# Altium schematic sheet Sheet1.SchDoc
size A4; SheetNumber: 1; SheetTotal: 1
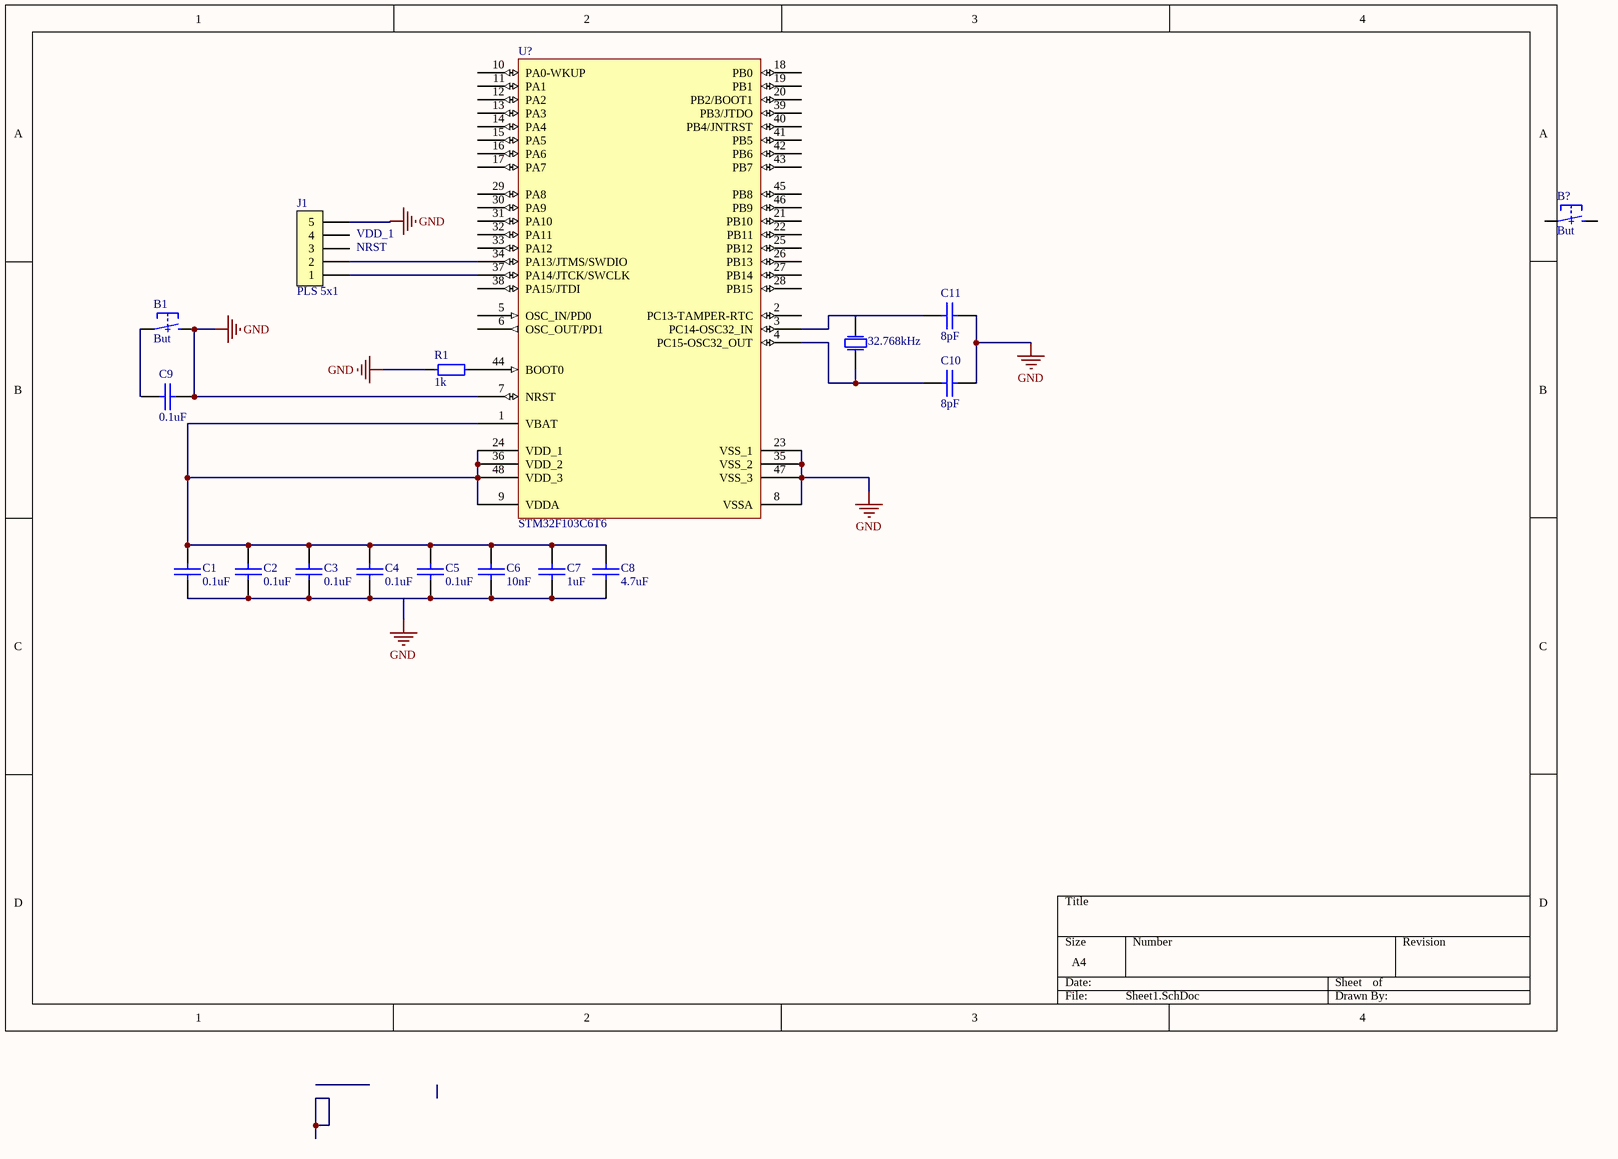
[diagram p0: Sheet1.SchDoc]

## Parts
?  32.768kHz  [Crystal ABM]
B1  But  [BUTTON 6x3.5]
B?  But  [BUTTON 6x3.5]
C1  0.1uF  [0805 Capicator]
C2  0.1uF  [0805 Capicator]
C3  0.1uF  [0805 Capicator]
C4  0.1uF  [0805 Capicator]
C5  0.1uF  [0805 Capicator]
C6  10nF  [0805 Capicator]
C7  1uF  [0805 Capicator]
C8  4.7uF  [0805 Capicator]
C9  0.1uF  [0805 Capicator]
C10  8pF  [0805 Capicator]
C11  8pF  [0805 Capicator]
J1  PLS 5x1  [PLS 5x1]
R1  1k  [0805 Resistor]
U?  STM32F103C6T6  [LQFP48_N]

## Nets
GND: B1.2 C9.2 C10.2 C11.2 J1.5 R1.1 U?.7(NRST) U?.8(VSSA) U?.23(VSS_1) U?.35(VSS_2) U?.47(VSS_3)
Net?_1: ?.1 C10.1 U?.4(PC15-OSC32_OUT)
NetC1_1: C1.1 C2.1 C3.1 C4.1 C5.1 C6.1 C7.1 C8.1
NetC1_2: C1.2 C2.2 C3.2 C4.2 C5.2 C6.2 C7.2 C8.2 U?.1(VBAT) U?.9(VDDA) U?.24(VDD_1) U?.36(VDD_2) U?.48(VDD_3)
NetC11_1: C11.1 U?.3(PC14-OSC32_IN)
NetJ1_1: J1.1 U?.37(PA14/JTCK/SWCLK)
NetJ1_2: J1.2 U?.34(PA13/JTMS/SWDIO)
NetR1_2: R1.2 U?.44(BOOT0)

Not connected (* = marked no-connect by the designer): ? 2; B1 1; B? 1 2; C9 1; J1 3 4; U? 2(PC13-TAMPER-RTC) 5(OSC_IN/PD0) 6(OSC_OUT/PD1) 10(PA0-WKUP) 11(PA1) 12(PA2) 13(PA3) 14(PA4) 15(PA5) 16(PA6) 17(PA7) 18(PB0) 19(PB1) 20(PB2/BOOT1) 21(PB10) 22(PB11) 25(PB12) 26(PB13) 27(PB14) 28(PB15) 29(PA8) 30(PA9) 31(PA10) 32(PA11) 33(PA12) 38(PA15/JTDI) 39(PB3/JTDO) 40(PB4/JNTRST) 41(PB5) 42(PB6) 43(PB7) 45(PB8) 46(PB9)

## Notes on the sheet
- (near J1) VDD_1
- (near J1) NRST

## Library data of the parts
? = Crystal 32.768kHz: 32.768kHz, SMD, 6 pF; Manufacturer: Seiko; Part Number: 9000417960; Type: Crystal; ComponentLink1Description: Chip&Dip; ComponentLink1URL: https://www.chipdip.ru/product/32.768-khz-smd-8mmx3.8mm-6-pf
B1 B? = Button 2 Conn: Button 2 Conn SMD; Part Number: L-KLS7-TS3608-5.0-180; Manufacturer: KLS electronic co ltd; Type: Button; ComponentLink1Description: Chip&Dip; ComponentLink1URL: https://www.chipdip.ru/product/kls7-ts3608-5.0-180-td-02xa
C1-C5 C9 = Cap 0.1uF (0805): 0.1uF X7R 25V 10% 0805; Manufacturer: Murata Manufacturing; Part Number: GRM21BR71E104KA01L; Type: Capacitor; ComponentLink1Description: Chip&Dip; ComponentLink1URL: https://www.chipdip.ru/product/grm21br71e104ka01l
C6 = Cap 10nF (0805): 0805 X7R 10nF 100V 10%; Manufacturer: Murata Manufacturing; Part Number: GRM21BR72A103KA01L; Type: Capacitor; ComponentLink1Description: Chip&Dip; ComponentLink1URL: https://www.chipdip.ru/product/grm21br72a103ka01l
C7 = Cap 1uF (0805): 1uF X7R 10% 16V 0805; Manufacturer: Murata Manufacturing; Part Number: GRM21BR71C105KA01K; Type: Capacitor; ComponentLink1Description: Chip&Dip; ComponentLink1URL: https://www.chipdip.ru/product/grm21br71c105k
C8 = Cap 4.7uF (0805): 4.7uF X5R 10% 25V 0805; Manufacturer: Murata Manufacturing; Part Number: GRM21BR61E475KA12L; Type: Capacitor; ComponentLink1Description: Chip&Dip; ComponentLink1URL: https://www.chipdip.ru/product/grm21br61e475ka12l
C10 C11 = Cap 8pF (0805)_1: 8pF NPO 50V, 5%, 0805; Manufacturer: Murata Manufacturing; Part Number: MLCC8.0pFNPO50V5%0805; Type: Capacitor; ComponentLink1Description: Chip&Dip; ComponentLink1URL: https://www.chipdip.ru/product0/180505270
J1 = Conn 5 (PLS): Header, 5-Pin
R1 = Res 1k (0805): 0.125W 0805 1k, 1%; Part Number: RC0805FR-071KL; Manufacturer: Taiwan; Type: Resistor; ComponentLink1Description: Chip&Dip; ComponentLink1URL: https://www.chipdip.ru/product0/9000079486
U? = STM32F103C6T6: STM32 ARM-based 32-bit MCU with 32 Kbytes Flash, 48-pin LQFP, Industrial Temperature; Published: 30-May-2008; DatasheetVersion: rev6, Mar-2008; PackageVersion: Mar-2008; PackageReference: LQFP48; Publisher: Altium Limited; PackageDescription: 48-Pin Low-Profile Quad Flat Pack, 7 x 7 mm Body, 0.5 mm Pitch (LQFP48); ComponentLink1Description: Manufacturer Link; ComponentLink1URL: www.st.com/stm32; ComponentLink2Description: Datasheet; ComponentLink2URL: http://www.st.com/stonline/products/literature/ds/13587.pdf